# Altium schematic sheet power.SchDoc
size A3
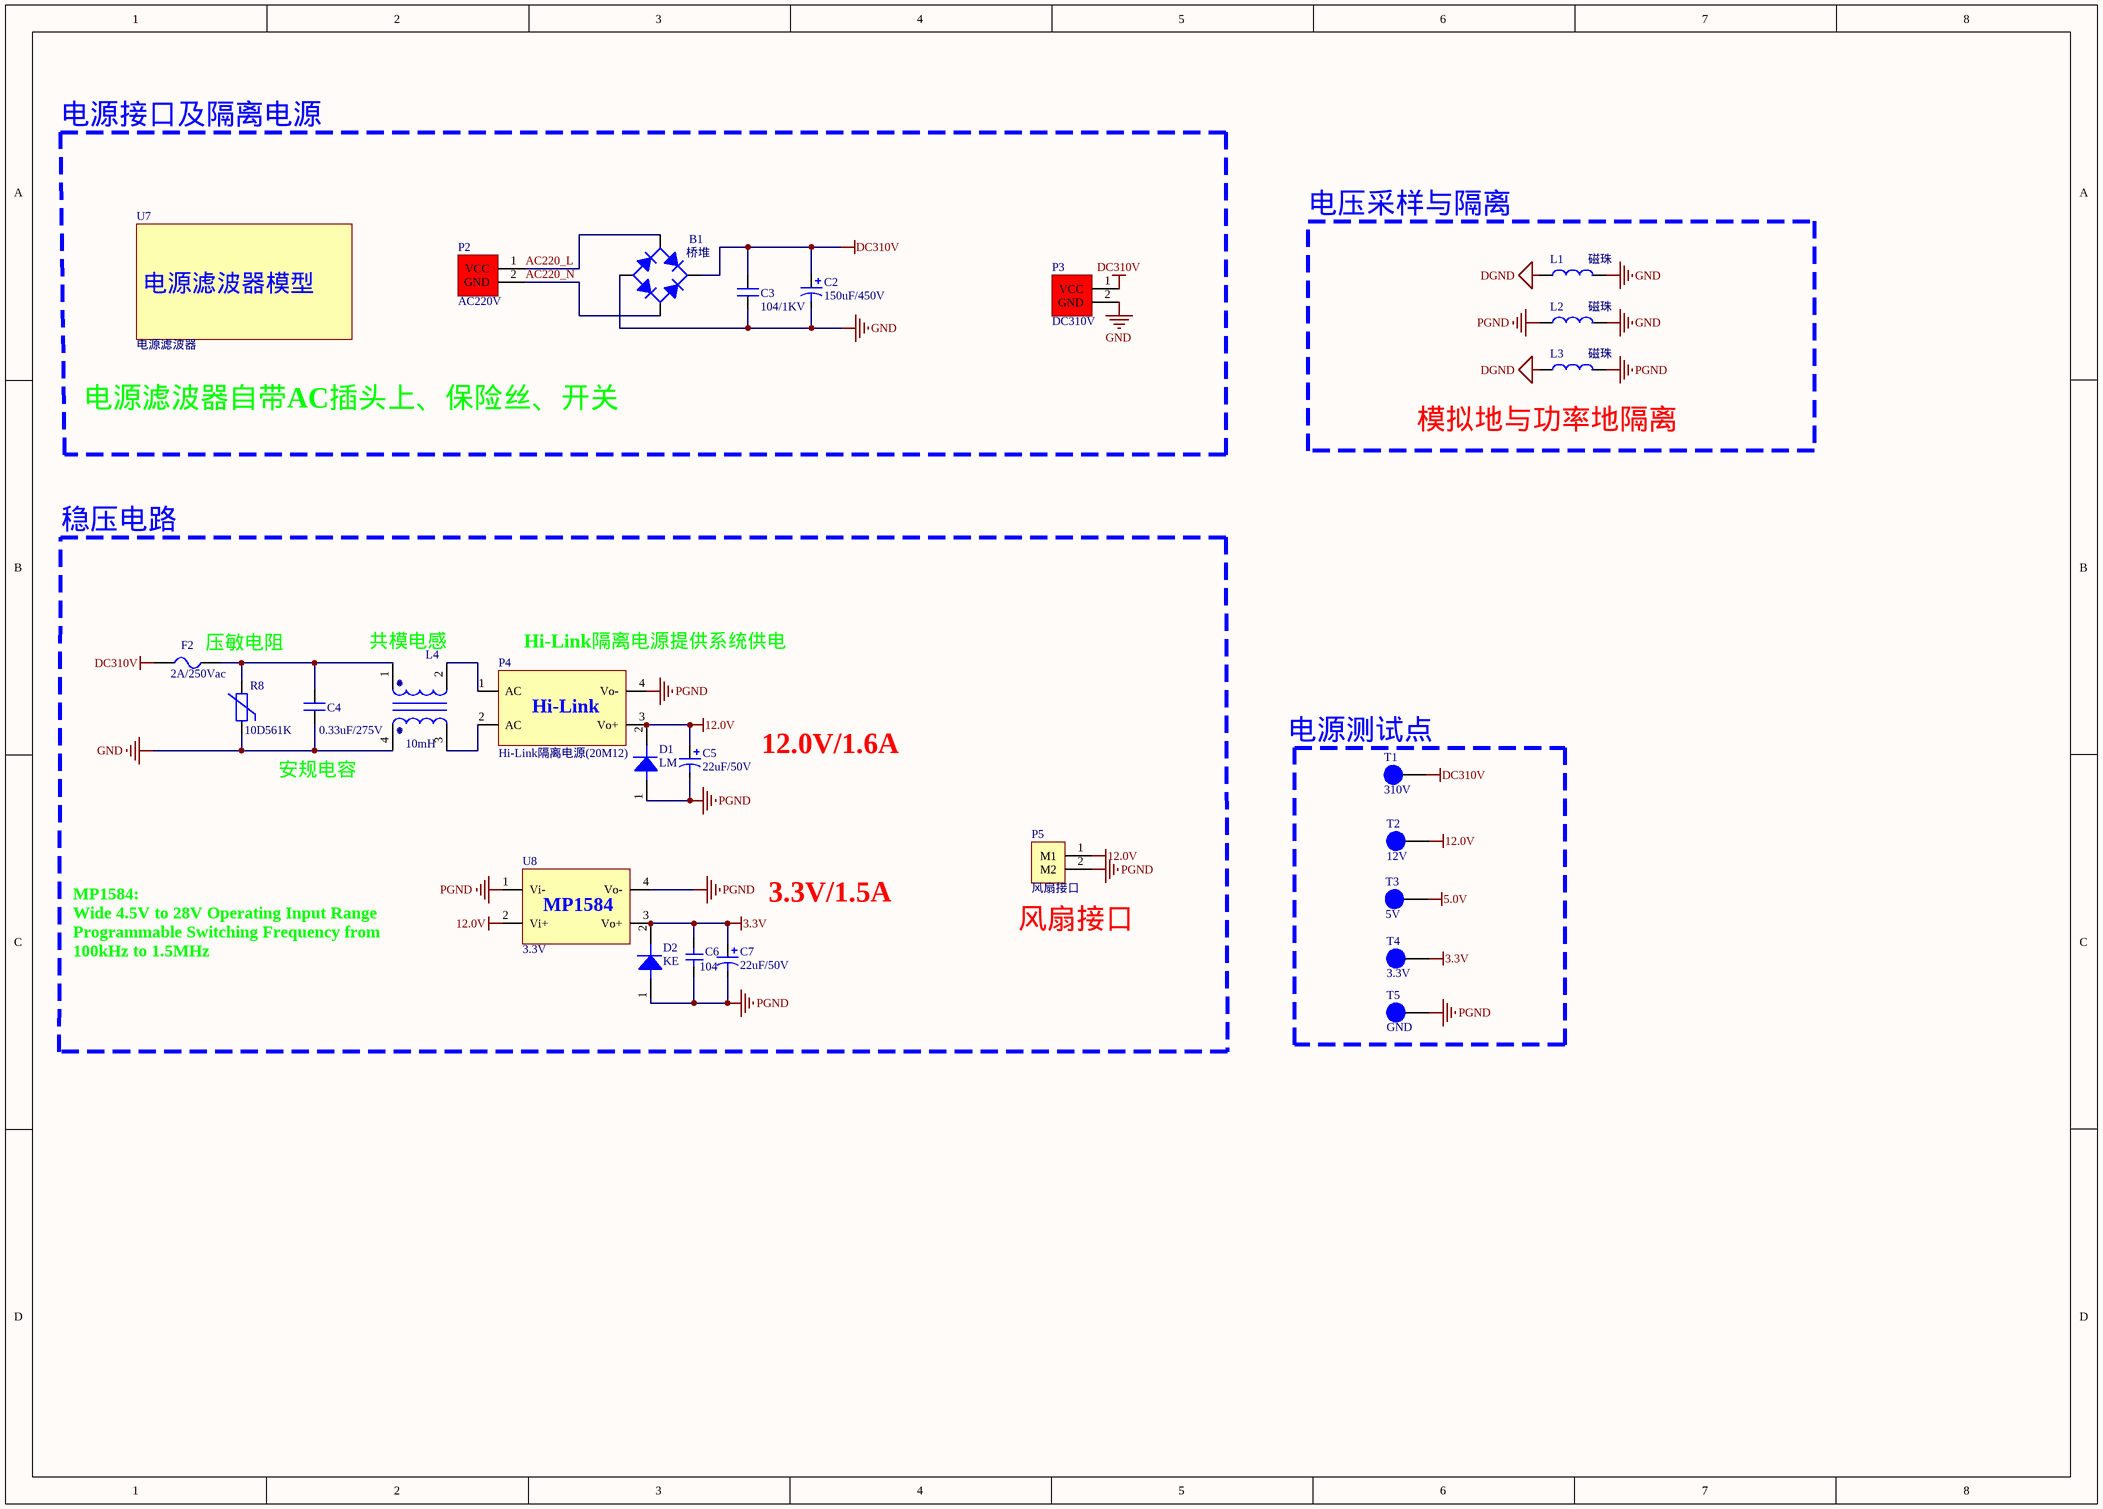
[diagram p0: power.SchDoc]

## Parts
B1  桥堆  [KBPC1010]
C2  150uF/450V  [CAP 7.5*18*35.5-H - BK]
C3  104/1KV  [CY 5*7*2.5]
C4  0.33uF/275V  [安规电容 x2v-18w15h5-9t5-p15]
C5  22uF/50V  [CM D(6.3*5.4)]
C6  104  [0805C]
C7  22uF/50V  [CM D(6.3*5.4)]
D1  LM  [SMA]
D2  KE  [SMA]
F2  2A/250Vac  [FU 5x20]
L1  磁珠  [1206L]
L2  磁珠  [1206L]
L3  磁珠  [1206L]
L4  10mH  [T12x6x4]
P2  AC220V  [XT30-F]
P3  DC310V  [XT30-F]
P4  Hi-Link隔离电源(20M12)  [HLK-20M24]
P5  风扇接口  [XH2/2.54mm/180]
R8  10D561K  [VDR 10D-4.5]
T1  310V  [HEADER 1]
T2  12V  [HEADER 1]
T3  5V  [HEADER 1]
T4  3.3V  [HEADER 1]
T5  GND  [HEADER 1]
U7  电源滤波器  [电源滤波器绿灯开关双保险]
U8  3.3V  [MP1584电源模块]

## Nets
3.3V: C6.2 C7.1 D2.2 T4.1 U8.3(Vo+)
5.0V: T3.1
12.0V: C5.1 D1.2 P4.3(Vo+) P5.1(M1) T2.1 U8.2(Vi+)
DC310V: B1.DC+ C2.1 C3.2 F2.1 P3.1(VCC) T1.1
DGND: L1.1 L3.1
GND: B1.DC- C2.2 C3.1 C4.1 L1.2 L2.2 L4.4 P3.2(GND) R8.1
PGND: C5.2 C6.1 C7.2 D1.1 D2.1 L2.1 L3.2 P4.4(Vo-) P5.2(M2) T5.1 U8.1(Vi-) U8.4(Vo-)
AC220_L: B1.AC1 P2.1(VCC)
AC220_N: B1.AC2 P2.2(GND)
NetC4_2: C4.2 F2.2 L4.1 R8.2
NetL4_2: L4.2 P4.1(AC)
NetL4_3: L4.3 P4.2(AC)

## Notes on the sheet
- 电源接口及隔离电源
- 电压采样与隔离
- (near U7) 电源滤波器自带AC插头上、保险丝、开关
- (near L3) 模拟地与功率地隔离
- 稳压电路
- (near F2) 压敏电阻
- (near L4) 共模电感
- (near P4) Hi-Link隔离电源提供系统供电
- 安规电容
- 12.0V/1.6A
- (near T1) 电源测试点
- 3.3V/1.5A
- MP1584:
  Wide 4.5V to 28V Operating Input Range
  Programmable Switching Frequency from
  100kHz to 1.5MHz
- (near P5) 风扇接口
- (in symbol HILINK-24V) Hi-Link
- (in symbol MP1584电源模块) MP1584
- (in symbol 电源滤波器绿灯开关双保险) 电源滤波器模型

## Library data of the parts
C2 C5 C7 = Cap3: 直插极性电容
C3 C4 = Cap2: 无极直插电容
C6 = Cap1: 无极贴片电容
D1 D2 = Diode: 二极管
F2 = Fuse: 保险丝
L1-L3 = L: 电感
L4 = 共模电感
P2 P3 = 电源端子
P4 = HILINK-24V
P5 = 接线端子-2PIN: 2PIN
R8 = 压敏电阻
T1-T5 = 测试点
U7 = 电源滤波器绿灯开关双保险
U8 = MP1584电源模块